# EAGLE design noodle (EAGLE 7.2.0)
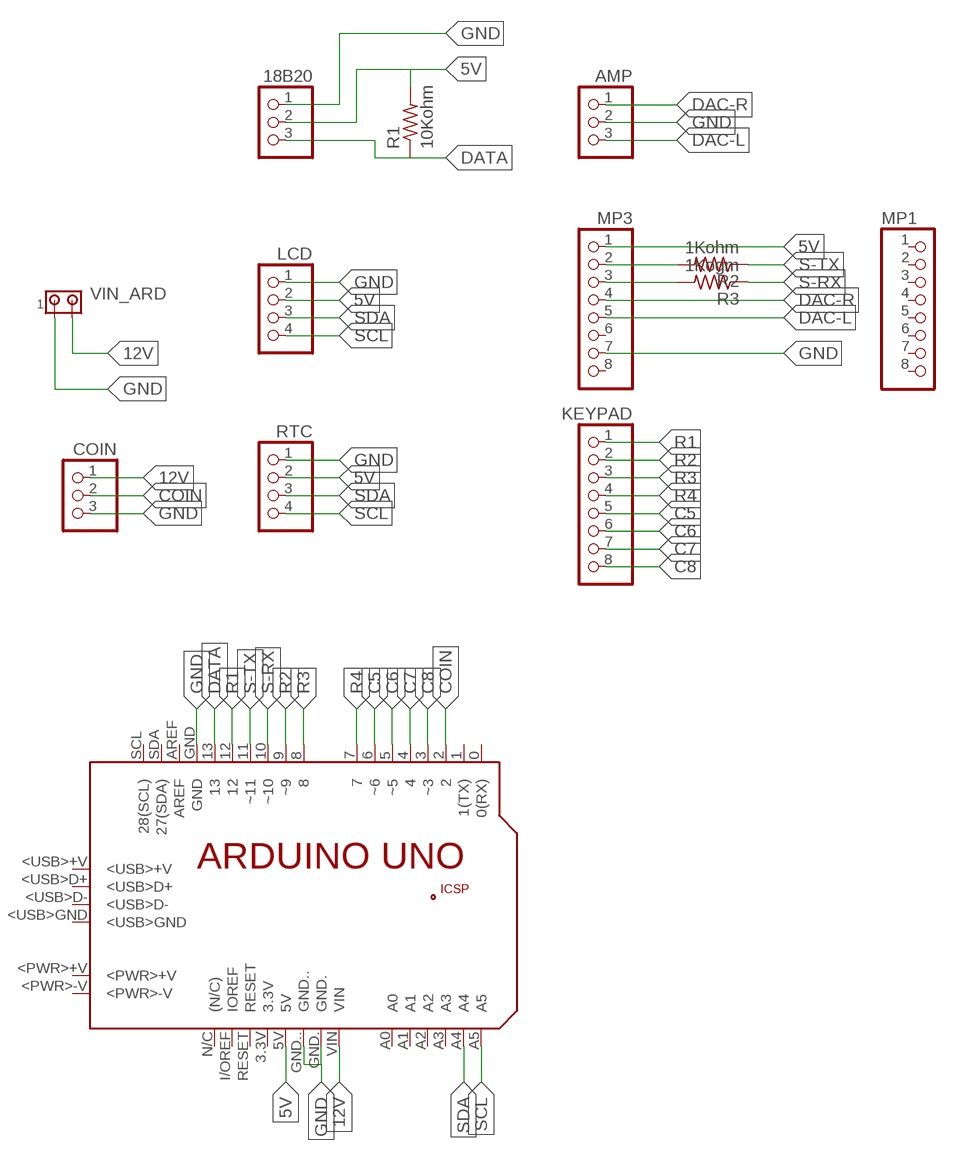
[diagram p0: schematic, sheet 1]

## Parts
18B20  PINHD-1X3  [1X03]
AMP  PINHD-1X3  [1X03]
COIN  PINHD-1X3  [1X03]
KEYPAD  PINHD-1X8  [1X08]
LCD  PINHD-1X4  [1X04]
MP1  PINHD-1X8  [1X08]
MP3  PINHD-1X8  [1X08]
PCB1  ARDUINO_UNO  [ARDUINO_UNO]
R1  10Kohm  R-US_0207/10  [0207/10]
R2  1Kohm  R-US_0207/10  [0207/10]
R3  1Kogm  R-US_0207/10  [0207/10]
RTC  PINHD-1X4  [1X04]
VIN_ARD  MTA02-156  [1X2MTA]

## Nets
5V: 18B20.2 LCD.2 MP3.1 PCB1.5V R1.2 RTC.2
12V: COIN.1 PCB1.VIN VIN_ARD.2
C5: KEYPAD.5 PCB1.6(~6)
C6: KEYPAD.6 PCB1.5(~5)
C7: KEYPAD.7 PCB1.4
C8: KEYPAD.8 PCB1.3(~3)
COIN: COIN.2 PCB1.2
DAC-L: AMP.3 MP3.5
DAC-R: AMP.1 MP3.4
DATA: 18B20.3 PCB1.13 R1.1
GND: 18B20.1 AMP.2 COIN.3 LCD.1 MP3.7 PCB1.GND PCB1.GND. PCB1.GND.. RTC.1 VIN_ARD.1
N$7: MP3.2 R2.2
N$8: MP3.3 R3.2
R1: KEYPAD.1 PCB1.12
R2: KEYPAD.2 PCB1.9(~9)
R3: KEYPAD.3 PCB1.8
R4: KEYPAD.4 PCB1.7
S-RX: PCB1.10(~10) R3.1
S-TX: PCB1.11(~11) R2.1
SCL: LCD.4 PCB1.A5 RTC.4
SDA: LCD.3 PCB1.A4 RTC.3
Unconnected: MP1.1 MP1.2 MP1.3 MP1.4 MP1.5 MP1.6 MP1.7 MP1.8 MP3.6 MP3.8 PCB1.0(0(RX)) PCB1.1(1(TX)) PCB1.3.3V PCB1.+5V PCB1.<PWR>+V PCB1.<PWR>-V PCB1.<USB>+V PCB1.<USB>D+ PCB1.<USB>D- PCB1.<USB>GND PCB1.A0 PCB1.A1 PCB1.A2 PCB1.A3 PCB1.AREF PCB1.GND_ PCB1.I/OREF(IOREF) PCB1.MISO PCB1.MOSI PCB1.N/C((N/C)) PCB1.RESET PCB1.RESET. PCB1.SCK PCB1.SCL(28(SCL)) PCB1.SDA(27(SDA))

## Library data of the parts
18B20 AMP COIN = pinhead:PINHD-1X3: PIN HEADER
KEYPAD MP1 MP3 = pinhead:PINHD-1X8: PIN HEADER
LCD RTC = pinhead:PINHD-1X4: PIN HEADER
PCB1 = E14_Arduino:ARDUINO_UNO: Device for representing an Arduino Uno board with a footprint in an EAGLE design. Created by Dave Young for Element14. More EAGLE documentation at: http://www.element14.com/community/community/knode/cadsoft_eagle
R1-R3 = adafruit:R-US_: RESISTOR, American symbol
VIN_ARD = con-amp:MTA02-156: AMP connector

## Board
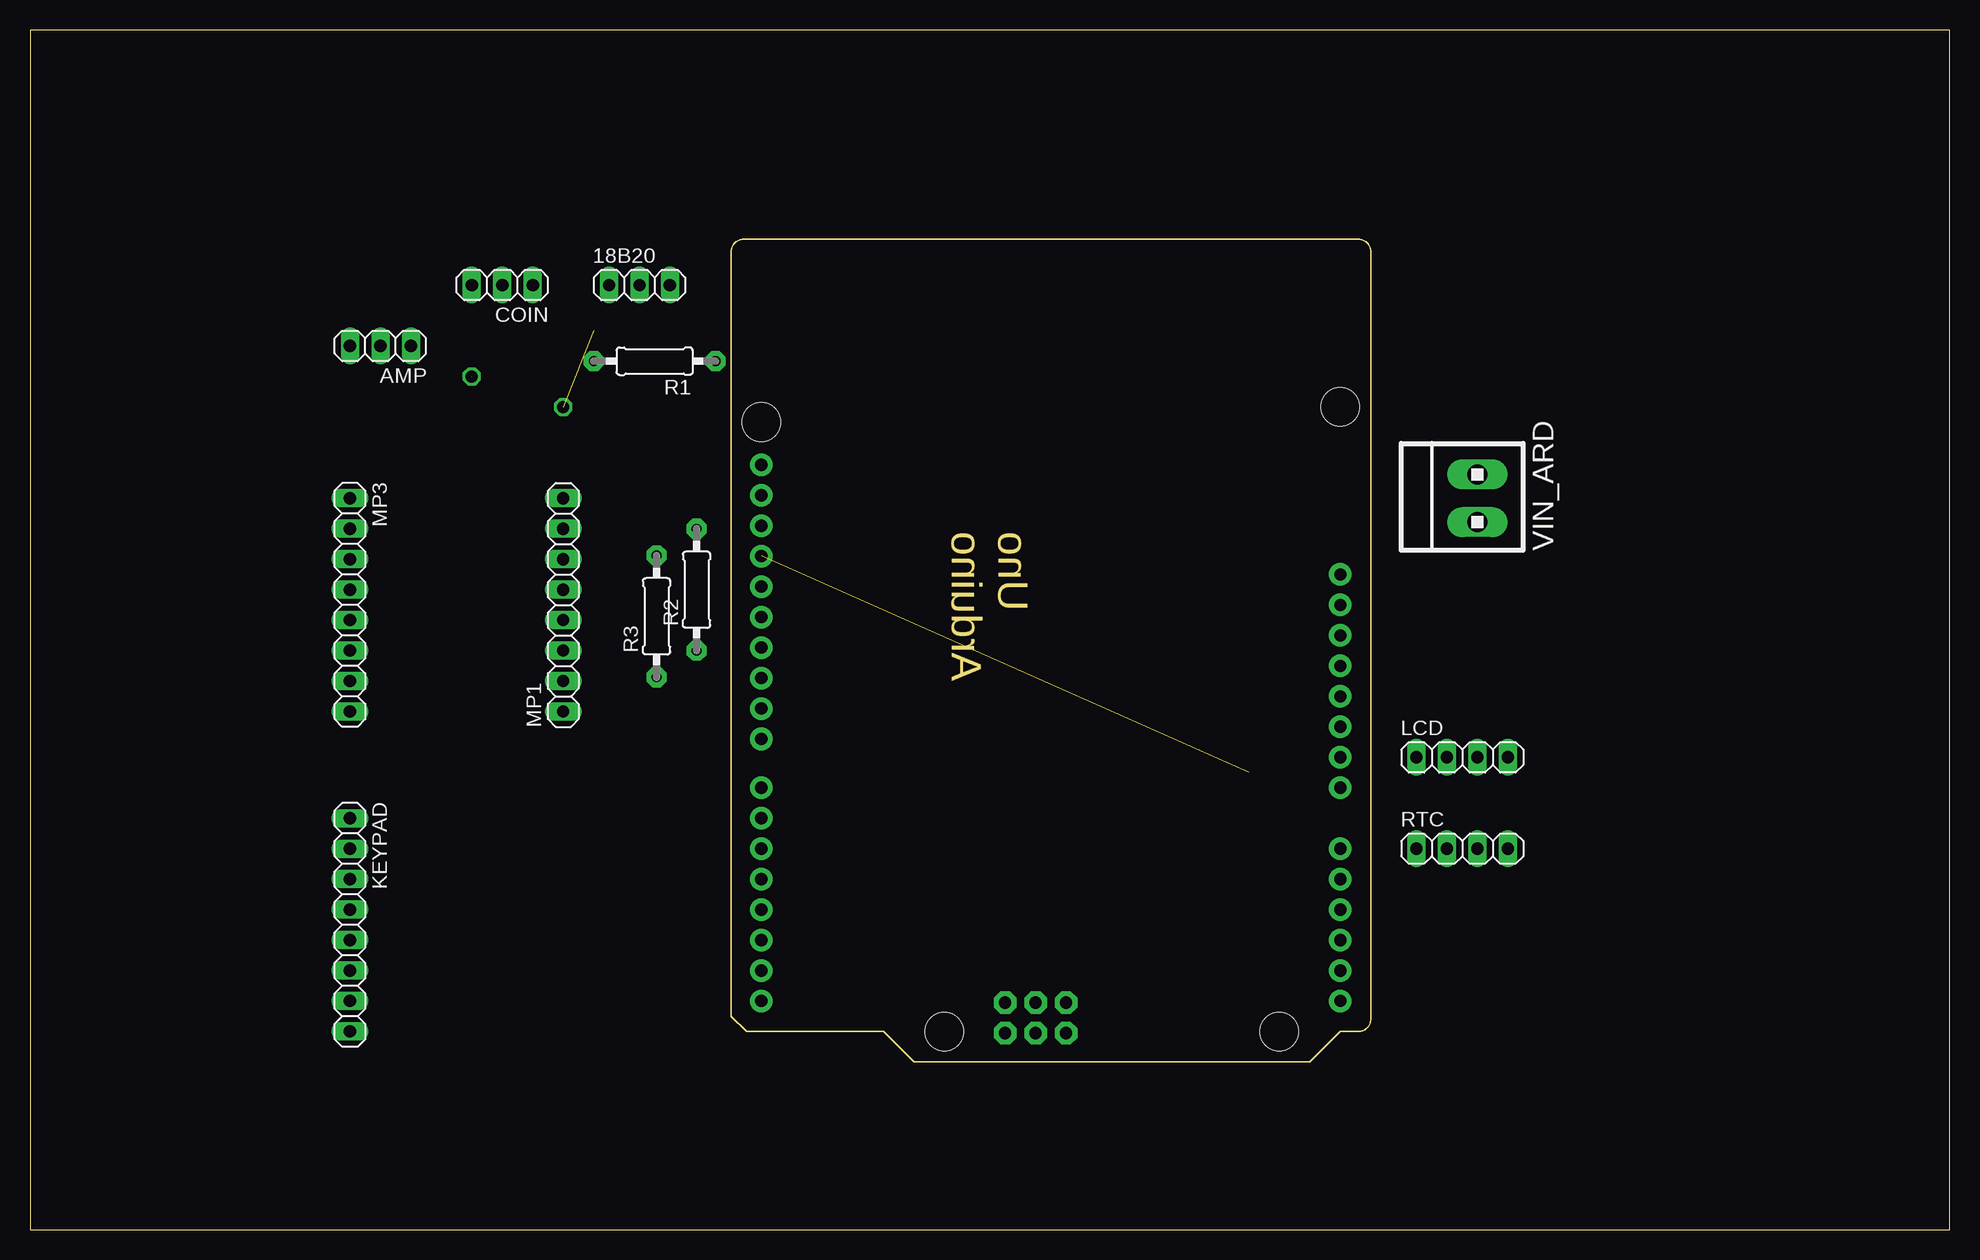
[diagram p1: board, top side]
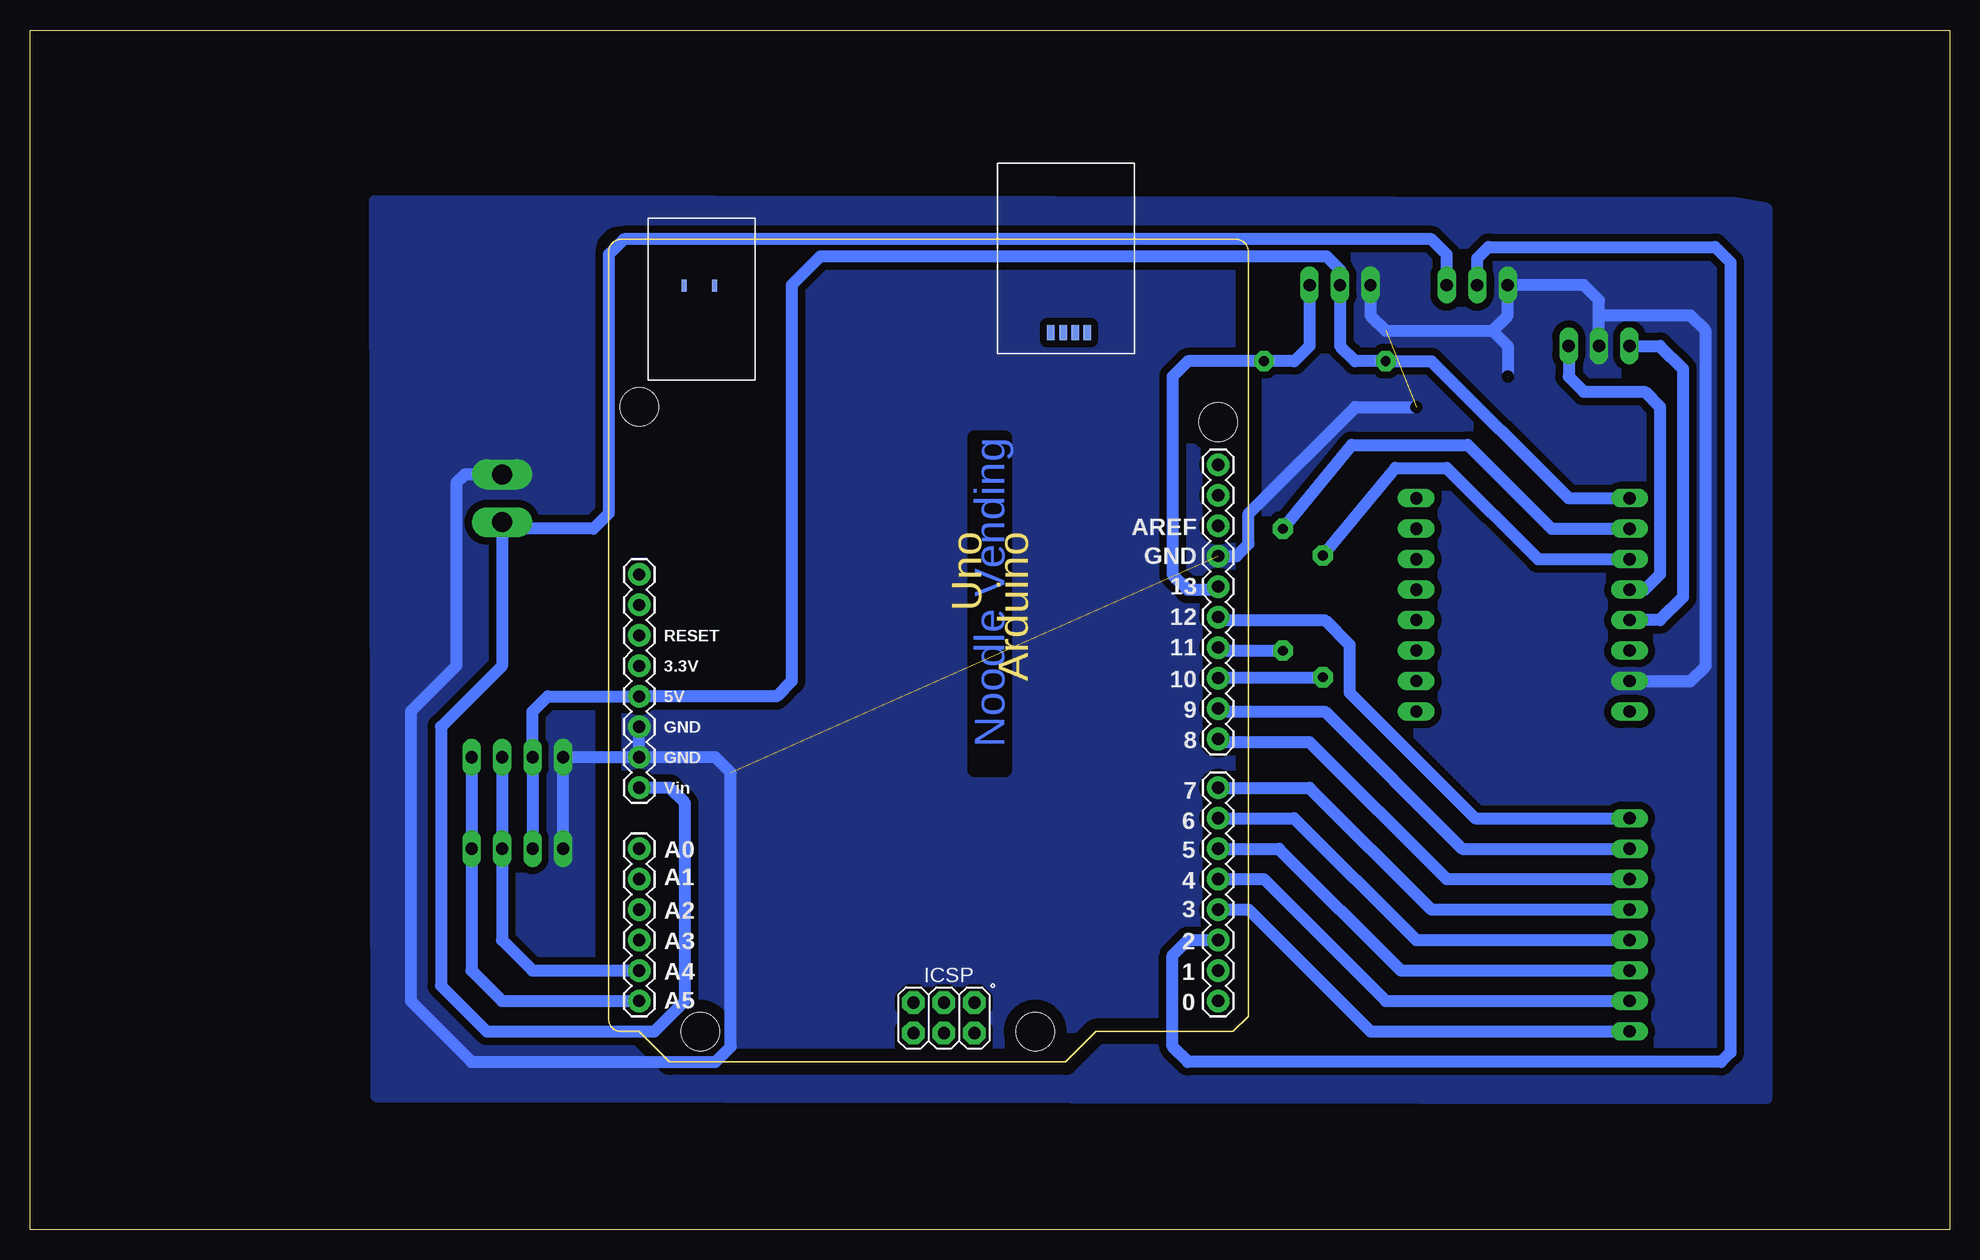
[diagram p2: board, bottom side, seen from below]

Size 160 x 100 mm. Coordinates in mm from the lower left corner, seen from the top.
Outline: 0,0 160,0 160,100 0,100 0,0
Copper layers (1*2): Top 0.035mm / dielectric 1.5mm / Route2 0.035mm
Design rules "default": minimum track width 10mil, minimum drill 12mil, track to track 8mil, track to pad 8mil, pad to pad 8mil, via to via 8mil, smd to smd 8mil, copper to edge 40mil, drill to drill 8mil, minimum pad ring 10mil, minimum via ring 8mil, stop-mask expansion 4mil, vias tented up to drill 0mil, thermal gap 10mil

### Footprints (pad centres in the part's own frame; a part is rotated, then mirrored left to right if it is on the bottom)
1X03 = drill 1.016 long: 1 -2.54,0; 2 0,0; 3 2.54,0
1X08 = drill 1.016 long: 1 -8.89,0; 2 -6.35,0; 3 -3.81,0; 4 -1.27,0; 5 1.27,0; 6 3.81,0; 7 6.35,0; 8 8.89,0
1X04 = drill 1.016 long: 1 -3.81,0; 2 -1.27,0; 3 1.27,0; 4 3.81,0
ARDUINO_UNO = drill 1.016 pad 1.88: 0 63.5,50.8; 1 60.96,50.8; 2 58.42,50.8; 3 55.88,50.8; 3.3V 35.56,2.54; 4 53.34,50.8; 5 50.8,50.8; 5V 38.1,2.54; 6 48.26,50.8; 7 45.72,50.8; 8 41.656,50.8; 9 39.116,50.8; 10 36.576,50.8; 11 34.036,50.8; 12 31.496,50.8; 13 28.956,50.8; A0 50.8,2.54; A1 53.34,2.54; A2 55.88,2.54; A3 58.42,2.54; A4 60.96,2.54; A5 63.5,2.54; AREF 23.876,50.8; GND 26.416,50.8; GND. 43.18,2.54; GND.. 40.64,2.54; I/OREF 30.48,2.54; N/C 27.94,2.54; RESET 33.02,2.54; SCL 18.796,50.8; SDA 21.336,50.8; VIN 45.72,2.54 | drill 1.016 pad 1.88 octagon: +5V 66.167,30.48; GND_ 66.167,25.4; MISO 63.627,30.48; MOSI 66.167,27.94; RESET. 63.627,25.4; SCK 63.627,27.94 | smd 1.016 x 0.508: <PWR>+V 3.861,8.814; <PWR>-V 3.861,6.274 | smd 1.27 x 0.635: <USB>+V 7.772,39.878; <USB>D+ 7.772,38.887; <USB>D- 7.772,37.871; <USB>GND 7.772,36.83 | hole 3.2: 66.04,7.62; 66.04,35.56; 15.24,50.8; 13.97,2.54
0207/10 = drill 0.813 pad 1.676 octagon: 1 -5.08,0; 2 5.08,0
1X2MTA = drill 1.676 long: 1 1.981,0; 2 -1.981,0

### Placement (x,y rotation side)
18B20  50.8,78.74 0 top
AMP  29.21,73.66 180 top
COIN  39.37,78.74 180 top
KEYPAD  26.67,25.4 270 top
LCD  119.38,39.37 0 top
MP1  44.45,52.07 90 top
MP3  26.67,52.07 270 top
PCB1  111.76,82.55 270 bottom
R1  52.07,72.39 180 top
R2  55.56,53.34 90 top
R3  52.23,51.12 90 top
RTC  119.38,31.75 0 top
VIN_ARD  120.65,60.96 90 top

### Tracks (layer width: path | path; a pad name or v marks a point on that pad's centre or on a via)
5V
  Bottom 1.016: RTC.2 LCD.2 118.11,43.18 116.84,44.45 PCB1.5V 97.79,44.45 96.52,45.72 96.52,78.74 94.14,81.12 51.91,81.12 50.8,80.01 18B20.2 50.8,73.66 49.53,72.39 R1.2 43.18,72.39 31.75,60.96 MP3.1
12V
  Bottom 1.016: VIN_ARD.2 120.65,58.42 | 120.65,58.42 120.65,46.99 125.73,41.91 125.73,20.32 121.92,16.51 107.95,16.51 105.41,19.05 105.41,35.56 106.68,36.83 PCB1.VIN | COIN.1 41.91,81.28 43.18,82.55 110.49,82.55 111.76,81.28 111.76,59.69 113.03,58.42 120.65,58.42
C5
  Bottom 1.016: PCB1.6 54.61,34.29 44.45,24.13 KEYPAD.5
C6
  Bottom 1.016: PCB1.5 55.88,31.75 45.72,21.59 KEYPAD.6
C7
  Bottom 1.016: PCB1.4 57.15,29.21 46.99,19.05 KEYPAD.7
C8
  Bottom 1.016: PCB1.3 58.42,26.67 48.26,16.51 KEYPAD.8
COIN
  Bottom 1.016: COIN.2 39.37,80.96 38.42,81.92 19.53,81.92 18.26,80.64 18.26,14.76 19.05,13.97 63.5,13.97 64.77,15.24 64.77,22.86 63.5,24.13 PCB1.2
DAC-L
  Bottom 1.016: AMP.3 24.13,73.66 22.23,71.75 22.23,52.7 24.13,50.8 MP3.5
DAC-R
  Bottom 1.016: AMP.1 31.75,71.12 30.48,69.85 25.4,69.85 24.13,68.58 24.13,54.61 25.4,53.34 MP3.4
DATA
  Bottom 1.016: 18B20.3 53.34,73.66 54.61,72.39 R1.1 63.5,72.39 64.77,71.12 64.77,54.61 63.5,53.34 61.21,53.34 PCB1.13
GND  (via drill 1 layers 1-2)  (4 unrouted)
  Bottom 1.016: RTC.1 LCD.1 PCB1.GND. | PCB1.GND. PCB1.GND.. | VIN_ARD.1 123.75,62.94 124.46,62.23 124.46,46.99 128.27,43.18 128.27,19.05 123.19,13.97 102.87,13.97 101.6,15.24 101.6,38.1 102.87,39.37 PCB1.GND. | MP3.7 21.59,45.72 20.32,46.99 20.32,74.93 21.59,76.2 29.21,76.2 | AMP.2 29.21,76.2 | 29.21,76.2 29.21,77.47 30.48,78.74 COIN.3 36.83,76.2 38.1,74.93 | PCB1.GND 59.44,56.13 58.42,57.15 58.42,59.69 49.53,68.58 v44.45,68.58 | 18B20.1 48.26,76.2 46.99,74.93 38.1,74.93 | 38.1,74.93 36.83,73.66 v36.83,71.12
  pour Bottom (isolate 0.61, no thermals): 17.94,85.57 131.29,85.72 131.13,11.11 15.24,10.95 15.24,85.09
N$7
  Bottom 1.016: R2.2 49.85,65.41 40.16,65.41 33.18,58.42 MP3.2
N$8
  Bottom 1.016: R3.2 46.2,63.5 41.91,63.5 34.29,55.88 MP3.3
R1
  Bottom 1.016: PCB1.12 60.71,50.8 52.07,50.8 50.01,48.74 50.01,44.77 39.53,34.29 KEYPAD.1
R2
  Bottom 1.016: PCB1.9 60.71,43.18 52.07,43.18 40.64,31.75 KEYPAD.2
R3
  Bottom 1.016: PCB1.8 60.71,40.64 53.34,40.64 41.91,29.21 KEYPAD.3
R4
  Bottom 1.016: PCB1.7 53.34,36.83 43.18,26.67 KEYPAD.4
S-RX
  Bottom 1.016: PCB1.10 60.9,46.04 R3.1
S-TX
  Bottom 1.016: PCB1.11 60.71,48.26 R2.1
SCL
  Bottom 1.016: PCB1.A5 120.65,19.05 123.19,21.59 RTC.4 LCD.4
SDA
  Bottom 1.016: PCB1.A4 118.11,21.59 120.65,24.13 RTC.3 LCD.3

### Text on the board
Bottom: Noodle Vending